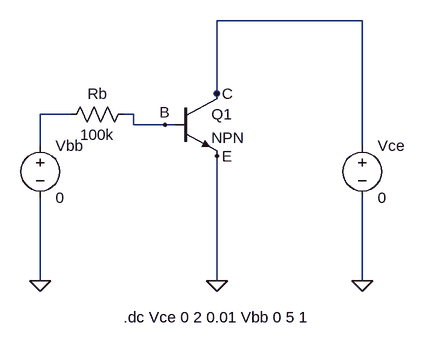
[diagram p0: schematic Task03.asc]
Task03.asc, the LTspice schematic file:
Version 4
SHEET 1 880 680
WIRE 480 -48 256 -48
WIRE 256 64 256 -48
WIRE 32 96 -16 96
WIRE 128 96 112 96
WIRE 128 112 128 96
WIRE 176 112 128 112
WIRE 192 112 176 112
WIRE -16 144 -16 96
WIRE 480 144 480 -48
WIRE -16 352 -16 224
WIRE 256 352 256 160
WIRE 480 352 480 224
WIRE 256 64 256 64
FLAG -16 352 0
FLAG 256 352 0
FLAG 480 352 0
FLAG 176 112 B
FLAG 256 64 C
FLAG 256 160 E
SYMBOL voltage 480 128 R0
SYMATTR InstName Vce
SYMATTR Value 0
SYMBOL voltage -16 128 R0
SYMATTR InstName Vbb
SYMATTR Value 0
SYMBOL res 16 112 R270
WINDOW 0 32 56 VTop 2
WINDOW 3 0 56 VBottom 2
SYMATTR InstName Rb
SYMATTR Value 100k
SYMBOL npn 192 64 R0
SYMATTR InstName Q1
TEXT 112 408 Left 2 !.dc Vce 0 2 0.01 Vbb 0 5 1

The netlist it stands for:
* Task03.asc
Vce C 0 0
Vbb N001 0 0
Rb N001 B 100k
Q1 C B 0 0 NPN
.model NPN NPN
.model PNP PNP
.lib standard.bjt
.dc Vce 0 2 0.01 Vbb 0 5 1
.backanno
.end